# Altium schematic sheet power.SchDoc: Power
size A; Revision: 0.0.1; SheetNumber: 3; SheetTotal: 4
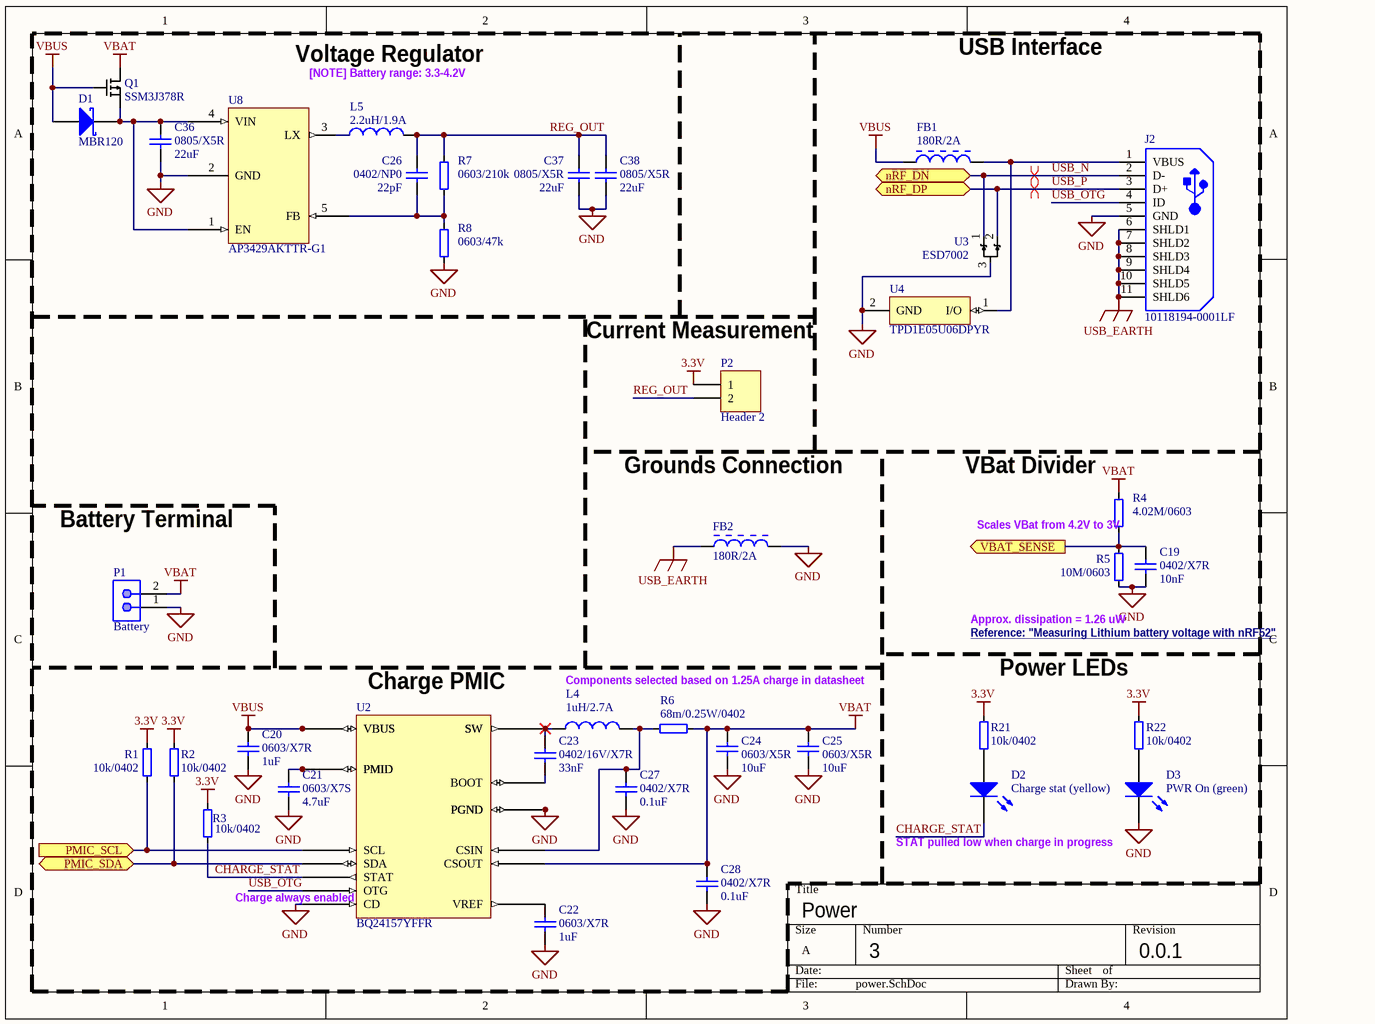
[diagram p0: power.SchDoc]

## Parts
C19  0402/X7R  value 10nF  [0402]
C20  0603/X7R  value 1uF  [CAPC1608X06L]
C21  0603/X7S  value 4.7uF  [CAPC1608X06L]
C22  0603/X7R  value 1uF  [CAPC1608X06L]
C23  0402/16V/X7R  value 33nF  [0402]
C24  0603/X5R  value 10uF  [CAPC1608X06L]
C25  0603/X5R  value 10uF  [CAPC1608X06L]
C26  0402/NP0  value 22pF  [0402]
C27  0402/X7R  value 0.1uF  [CAPC1005X04L]
C28  0402/X7R  value 0.1uF  [CAPC1005X04L]
C36  0805/X5R  value 22uF  [C0805]
C37  0805/X5R  value 22uF  [C0805]
C38  0805/X5R  value 22uF  [C0805]
D1  MBR120  [SODFL360X98-2N]
D2  Charge stat (yellow)  [3.2X1.6X1.1]
D3  PWR On (green)  [3.2X1.6X1.1]
FB1  180R/2A  [MURA-BLM18PG_KG-B25-CHIP-2_V2]
FB2  180R/2A  [MURA-BLM18PG_KG-B25-CHIP-2_V2]
J2  10118194-0001LF  [FCI-10118194-0001LF-5_V]
L4  1uH/2.7A  [INDC2520X12N]
L5  2.2uH/1.9A  [INDC2520X12N]
P1  Battery  [JST-B2B-XH-A_V]
P2  Header 2  [Current_TP]
Q1  SSM3J378R  [SOT-23_M]
R1  10k/0402  [0402]
R2  10k/0402  [0402]
R3  10k/0402  [0402]
R4  4.02M/0603  [1608[0603]]
R5  10M/0603  [1608[0603]]
R6  68m/0.25W/0402  [0402]
R7  0603/210k  [1608[0603]]
R8  0603/47k  [1608[0603]]
R21  10k/0402  [0402]
R22  10k/0402  [0402]
U2  BQ24157YFFR  [BQ24157YFFR]
U3  ESD7002  [SOT65P220X100-3N]
U4  TPD1E05U06DPYR  [0402-A]
U8  AP3429AKTTR-G1  [SOT95P280X100-5N]

## Ports
nRF_DN (bidir), nRF_DP (bidir), PMIC_SCL (in), PMIC_SDA (bidir), VBAT_SENSE (out)

## Nets
3.3V: P2.1 R1.2 R2.2 R3.2 R21.2 R22.2
GND: C19.2 C20.2 C21.2 C22.2 C24.2 C25.2 C27.1 C28.1 C36.2 C37.2 C38.2 D3.2(K) FB2.2 J2.5(GND) P1.1 R5.1 R8.1 U2.D1(PGND) U2.D2(PGND) U2.D3(PGND) U2.E2(CD) U3.3 U4.2(GND) U8.2(GND)
USB_EARTH: FB2.1 J2.6(SHLD1) J2.7(SHLD2) J2.8(SHLD3) J2.9(SHLD4) J2.10(SHLD5) J2.11(SHLD6)
VBAT: C24.1 C25.1 C28.2 P1.2 Q1.3(D) R4.2 R6.1 U2.E4(CSOUT)
VBUS: C20.1 D1.1(A) FB1.1 Q1.1(G) U2.A1(VBUS) U2.A2(VBUS)
CHARGE_STAT: D2.2(K) R3.1 U2.C4(STAT)
PMIC_SCL: R1.1 U2.A4(SCL) ; port PMIC_SCL
PMIC_SDA: R2.1 U2.B4(SDA) ; port PMIC_SDA
REG_OUT: C26.1 C37.1 C38.1 L5.2 P2.2 R7.2
USB_N: J2.2(D-) U3.1 ; port nRF_DN
USB_OTG: J2.4(ID) U2.D4(OTG)
USB_P: J2.3(D+) U3.2 ; port nRF_DP
VBAT_SENSE: C19.1 R4.1 R5.2 ; port VBAT_SENSE
NetC21_1: C21.1 U2.B1(PMID) U2.B2(PMID) U2.B3(PMID)
NetC22_1: C22.1 U2.E3(VREF)
NetC23_1: C23.1 L4.1 U2.C1(SW) U2.C2(SW) U2.C3(SW)
NetC23_2: C23.2 U2.A3(BOOT)
NetC26_2: C26.2 R7.1 R8.2 U8.5(FB)
NetC27_2: C27.2 L4.2 R6.2 U2.E1(CSIN)
NetC36_1: C36.1 D1.2(K) Q1.2(S) U8.1(EN) U8.4(VIN)
NetD2_1: D2.1(A) R21.1
NetD3_1: D3.1(A) R22.1
NetFB1_2: FB1.2 J2.1(VBUS) U4.1(I/O)
NetL5_1: L5.1 U8.3(LX)

## Layout directives
differential pair; differential pair class USB: USB_N, USB_P

## Notes on the sheet
- [NOTE] Battery range: 3.3-4.2V
- Voltage Regulator
- USB Interface
- (near P2) Current Measurement
- Grounds Connection
- (near R4) VBat Divider
- Battery Terminal
- (near R4) Scales VBat from 4.2V to 3V
- Approx. dissipation = 1.26 uW
- Reference: "Measuring Lithium battery voltage with nRF52" <https://devzone.nordicsemi.com/nordic/nordic-blog/b/blog/posts/measuring-lithium-battery-voltage-with-nrf52>
- (near U2) Charge PMIC
- Components selected based on 1.25A charge in datasheet
- Power LEDs
- (near U2) Charge always enabled
- STAT pulled low when charge in progress

## Library data of the parts
C19-C28 C36-C38 = Cap: Capacitor; Published: 8-Jun-2000; LatestRevisionDate: 17-Jul-2002; LatestRevisionNote: Re-released for DXP Platform.; PackageReference: RAD-0.3; Publisher: Altium Limited; PackageDescription: Radial Cap, Thru-Hole; 2 Leads; 0.3 in Pin Spacing; ComponentLink1Description: Digikey
  C19: ComponentLink1URL: https://www.digikey.com/product-detail/en/yageo/CC0402KRX7R7BB103/311-1042-1-ND/302959
  C20 C22: ComponentLink1URL: https://www.digikey.com/product-detail/en/avx-corporation/0603YC105JAT2A/478-10814-1-ND/7536449
  C21: ComponentLink1URL: https://www.digikey.com/product-detail/en/tdk-corporation/C1608X7S1A475K080AC/445-14258-1-ND/3955924
  C23: ComponentLink1URL: https://www.digikey.com/product-detail/en/samsung-electro-mechanics/CL05B333KO5NNNC/1276-1177-1-ND/3889263
  C24 C25: ComponentLink1URL: https://www.digikey.com/product-detail/en/samsung-electro-mechanics/CL10A106MQ8NNNC/1276-1119-1-ND/3889205
  C26: ComponentLink1URL: https://www.digikey.com/product-detail/en/yageo/CC0402JRNPO9BN220/311-1018-1-ND/302935
  C27 C28: ComponentLink1URL: https://www.digikey.com/product-detail/en/w-rth-elektronik/885012205037/732-7532-1-ND/5454159
  C36-C38: ComponentLink1URL: https://www.digikey.com/product-detail/en/samsung-electro-mechanics/CL21A226MQQNNNE/1276-1100-1-ND/3889186
D1 = D Schottky: Schottky Diode; Published: 8-Jun-2000; LatestRevisionDate: 17-Jul-2002; LatestRevisionNote: Re-released for DXP Platform.; PackageReference: SMB; Publisher: Altium Limited; PackageDescription: DO-214-AA/SMB; 2 C-Bend Leads; Body 5.3 x 3.6 mm, inc. leads (LxW); Code_JEDEC: DO-214-AA; ComponentLink1Description: Digikey; ComponentLink1URL: https://www.digikey.com/product-detail/en/on-semiconductor/MBR120ESFT1G/MBR120ESFT1GOSCT-ND/964525
D2 = LED2: Typical RED, GREEN, YELLOW, AMBER GaAs LED; MFG PN: LTST-C150KSKT; Published: 8-Jun-2000; LatestRevisionDate: 17-Jul-2002; LatestRevisionNote: Re-released for DXP Platform.; PackageVersion: Feb-2002; PackageReference: 3.2X1.6X1.1; Publisher: Altium Limited; PackageDescription: SM LED; 2 Flat Leads; Digikey PN: 160-1406-1-ND
D3 = LED2: Typical RED, GREEN, YELLOW, AMBER GaAs LED; MFG PN: LTST-C150KGKT; Published: 8-Jun-2000; LatestRevisionDate: 17-Jul-2002; LatestRevisionNote: Re-released for DXP Platform.; PackageVersion: Feb-2002; PackageReference: 3.2X1.6X1.1; Publisher: Altium Limited; PackageDescription: SM LED; 2 Flat Leads; Digikey PN: 160-1404-1-ND
FB1 FB2 = CMP-0686-00557-6: 180 Ohms @ 100MHz 1 Power Line Ferrite Bead 0603 (1608 Metric) 2A 50mOhm; PartNumber: MPZ1608S181ATAH0; Manufacturer: TDK Corporation; Impedance (at 100 MHz): 180 Ohm +/- 25%; Rated Current: 2000 mA; DC Resistance: 0.05 Ohm Max.; Packing: Tape and Reel; PackageDescription: 2-Pin Chip, Body 1.6 x 0.8 mm; Mounting Technology: Surface Mount; Operating Temperature Range: -55 to 125 degC; ComponentLink1Description: Digikey; ComponentLink1URL: https://www.digikey.com/product-detail/en/tdk-corporation/MPZ1608S181ATAH0/445-5220-1-ND/2117954; ComponentLink2Description: Datasheet; ComponentLink2URL: https://product.tdk.com/info/en/catalog/datasheets/beads_commercial_power_mpz1608_en.pdf
J2 = CMP-2000-05120-1: Micro USB B Type Receptacle, 1.8 A, -55 to 85 degC, 5-Pin SMD, RoHS, Tape and Reel; Manufacturer: Amphenol FCI; Body Orientation: RightAngle; Number of Contacts: 5; Pitch: 0.65mm; Gender: RCP; Rad Hard: No; Package Reference: 10118194-0001LF-5; Mounting: SurfaceMount; Manufacturer URL: http://www.fci.com/; Packaging: CutTape; Datasheet URL: https://datasheet.ciiva.com/26945/getdatasheetpartid-418619-26945695.pdf; Termination Method: Solder; Package Description: 5-Pin Surface Mount Device, Body 8.05 x 5.53 mm, Pitch 0.65 mm; Type: MicroUSBTypeB; Datasheet Version: Rev. A, 10/2011; ComponentLink1Description: Digikey; ComponentLink1URL: https://www.digikey.com/product-detail/en/amphenol-icc-fci/10118194-0001LF/609-4618-1-ND/2785382
L4 = MAMK2520T1R0M: Inductor Power Chip Wirewound 1uH 20% 2MHz Metal 2.7A 59mOhm DCR 1008 T/R; MF: Taiyo Yuden; Package: 2520 Taiyo Yuden; Digi-Key_Part_Number: 587-3225-1-ND; SnapEDA_Link: https://www.snapeda.com/parts/MAMK2520T1R0M/Taiyo%20Yuden/view-part/?ref=snap; Digi-Key_Purchase_URL: https://www.digikey.com/product-detail/en/taiyo-yuden/MAMK2520T1R0M/587-3225-1-ND/3479480?utm_source=snapeda&utm_medium=aggregator&utm_campaign=symbol; MP: MAMK2520T1R0M; Value: 1uH; ComponentLink1Description: Digikey; ComponentLink1URL: https://www.digikey.com/product-detail/en/taiyo-yuden/MAMK2520T1R0M/587-3225-1-ND/3479480
L5 = MAMK2520T1R0M: 2.2uH ±20% 1.9A 117mΩ 1008 Inductors (SMD) RoHS; MF: Taiyo Yuden; Package: 2520 Taiyo Yuden; Digi-Key_Part_Number: 587-3225-1-ND; SnapEDA_Link: https://www.snapeda.com/parts/MAMK2520T1R0M/Taiyo%20Yuden/view-part/?ref=snap; Digi-Key_Purchase_URL: https://www.digikey.com/product-detail/en/taiyo-yuden/MAMK2520T1R0M/587-3225-1-ND/3479480?utm_source=snapeda&utm_medium=aggregator&utm_campaign=symbol; MP: MAMK2520T1R0M; Value: 2.2uH; ComponentLink1Description: Digikey; ComponentLink1URL: https://www.digikey.com/product-detail/en/laird-signal-integrity-products/MGV2520122R2M-10/240-3077-1-ND/9559058
P1 = CMP-2000-05888-1: Male Header, Pitch 2.5 mm, 1 x 2 Position, Height 7 mm, Tail Length 3.4 mm, -25 to 85 degC, RoHS, Bulk; Manufacturer: JST; No of Positions: 2; Pitch: 2.5mm; Style/Orientation: StraightHeader/Plug; Datasheet Version: 05/2016; Package Description: Male Header, Pitch 2.5 mm, 1 x 2 Position, Height 7 mm, Tail Length 3.4 mm; Package Reference: B2B-XH-A; Mounting Technology: ThroughHole; Type: ShroudedHeader; Datasheet URL: http://www.jst-mfg.com/product/pdf/eng/eXH.pdf; Manufacturer URL: http://www.jst.com/home2.html; Termination: Crimp; ComponentLink1Description: Digikey; ComponentLink1URL: https://www.digikey.com/product-detail/en/jst-sales-america-inc/B2B-XH-A-LF-SN/455-2247-ND/1651045; ComponentLink2Description: Datasheet; ComponentLink2URL: http://www.jst-mfg.com/product/pdf/eng/eXH.pdf
P2 = Header 2: Header, 2-Pin; LatestRevisionDate: 17-Jul-2002; LatestRevisionNote: Re-released for DXP Platform.; Publisher: Altium Limited
Q1 = SSM3J378R: P-Channel 20V 6A (Ta) 1W (Ta) Surface Mount SOT-23F; ComponentLink1Description: Digikey; ComponentLink1URL: https://www.digikey.com/product-detail/en/toshiba-semiconductor-and-storage/SSM3J378R-LF/SSM3J378RLFCT-ND/9866097; ComponentLink2Description: Datasheet; ComponentLink2URL: https://toshiba.semicon-storage.com/info/docget.jsp?did=59205&prodName=SSM3J378R
R1-R8 R21 R22 = Resistor: Published: 8-Jun-2000; LatestRevisionDate: 17-Jul-2002; LatestRevisionNote: Re-released for DXP Platform.; PackageReference: AXIAL-0.4; Publisher: Altium Limited; PackageDescription: Axial Device, Thru-Hole; 2 Leads; 0.4 in Pin Spacing; ComponentLink1Description: Digikey
  R1-R3 R21 R22: ComponentLink1URL: https://www.digikey.com/product-detail/en/yageo/RC0402JR-0710KL/311-10KJRCT-ND/729365
  R4: ComponentLink1URL: https://www.digikey.com/product-detail/en/yageo/RC0603FR-074M02L/YAG5698CT-ND/7563718
  R5: ComponentLink1URL: https://www.digikey.com/product-detail/en/yageo/RC0603JR-0710ML/311-10MGRCT-ND/729648
  R6: ComponentLink1URL: https://www.digikey.com/product-detail/en/panasonic-electronic-components/ERJ-2BWFR068X/P.068ATCT-ND/1705799
  R7: ComponentLink1URL: https://www.digikey.com/product-detail/en/stackpole-electronics-inc/RMCF0603FT210K/RMCF0603FT210KCT-ND/2417983
  R8: ComponentLink1URL: https://www.digikey.com/product-detail/en/stackpole-electronics-inc/RMCF0603FT47K0/RMCF0603FT47K0CT-ND/1943099
U2 = BQ24157YFFR: Charger IC Lithium Ion/Polymer 20-DSBGA (2.1x2); ComponentLink1Description: Digikey; ComponentLink1URL: https://www.digikey.com/product-detail/en/texas-instruments/BQ24157YFFR/296-39908-1-ND/5177785; ComponentLink2Description: Datasheet; ComponentLink2URL: http://www.ti.com/lit/ds/symlink/bq24157.pdf; ComponentLink3Description: MFG Page; ComponentLink3URL: https://www.ti.com/product/BQ24157
U3 = ESD7002WTT1G: Clamp  Ipp Tvs Diode Surface Mount SC-70-3 (SOT323); ComponentLink1Description: Digikey; ComponentLink1URL: https://www.digikey.com/product-detail/en/on-semiconductor/ESD7002WTT1G/ESD7002WTT1GOSCT-ND/5801809; ComponentLink2Description: Datasheet; ComponentLink2URL: https://www.onsemi.com/pub/Collateral/ESD7002-D.PDF
U4 = TPD1E05U06DPYR: 14V Clamp 2.5A (8/20µs) Ipp Tvs Diode Surface Mount 2-X1SON (1x.60); ComponentLink1Description: Digikey; ComponentLink1URL: https://www.digikey.com/product-detail/en/texas-instruments/TPD1E05U06DPYR/296-39341-1-ND/5143293; ComponentLink2Description: Datasheet; ComponentLink2URL: http://www.ti.com/lit/ds/symlink/tpd1e05u06.pdf
U8 = AP3429AKTTR-G1: Buck Switching Regulator IC Positive Adjustable 0.6V 1 Output 2A SOT-23-5 Thin, TSOT-23-5; ComponentLink1Description: Digikey; ComponentLink1URL: https://www.digikey.com/product-detail/en/diodes-incorporated/AP3429AKTTR-G1/AP3429AKTTR-G1DICT-ND/5359842; ComponentLink2Description: Datasheet; ComponentLink2URL: https://www.diodes.com/assets/Datasheets/AP3429.pdf